# EAGLE design carrier-frontend (EAGLE 5.07)
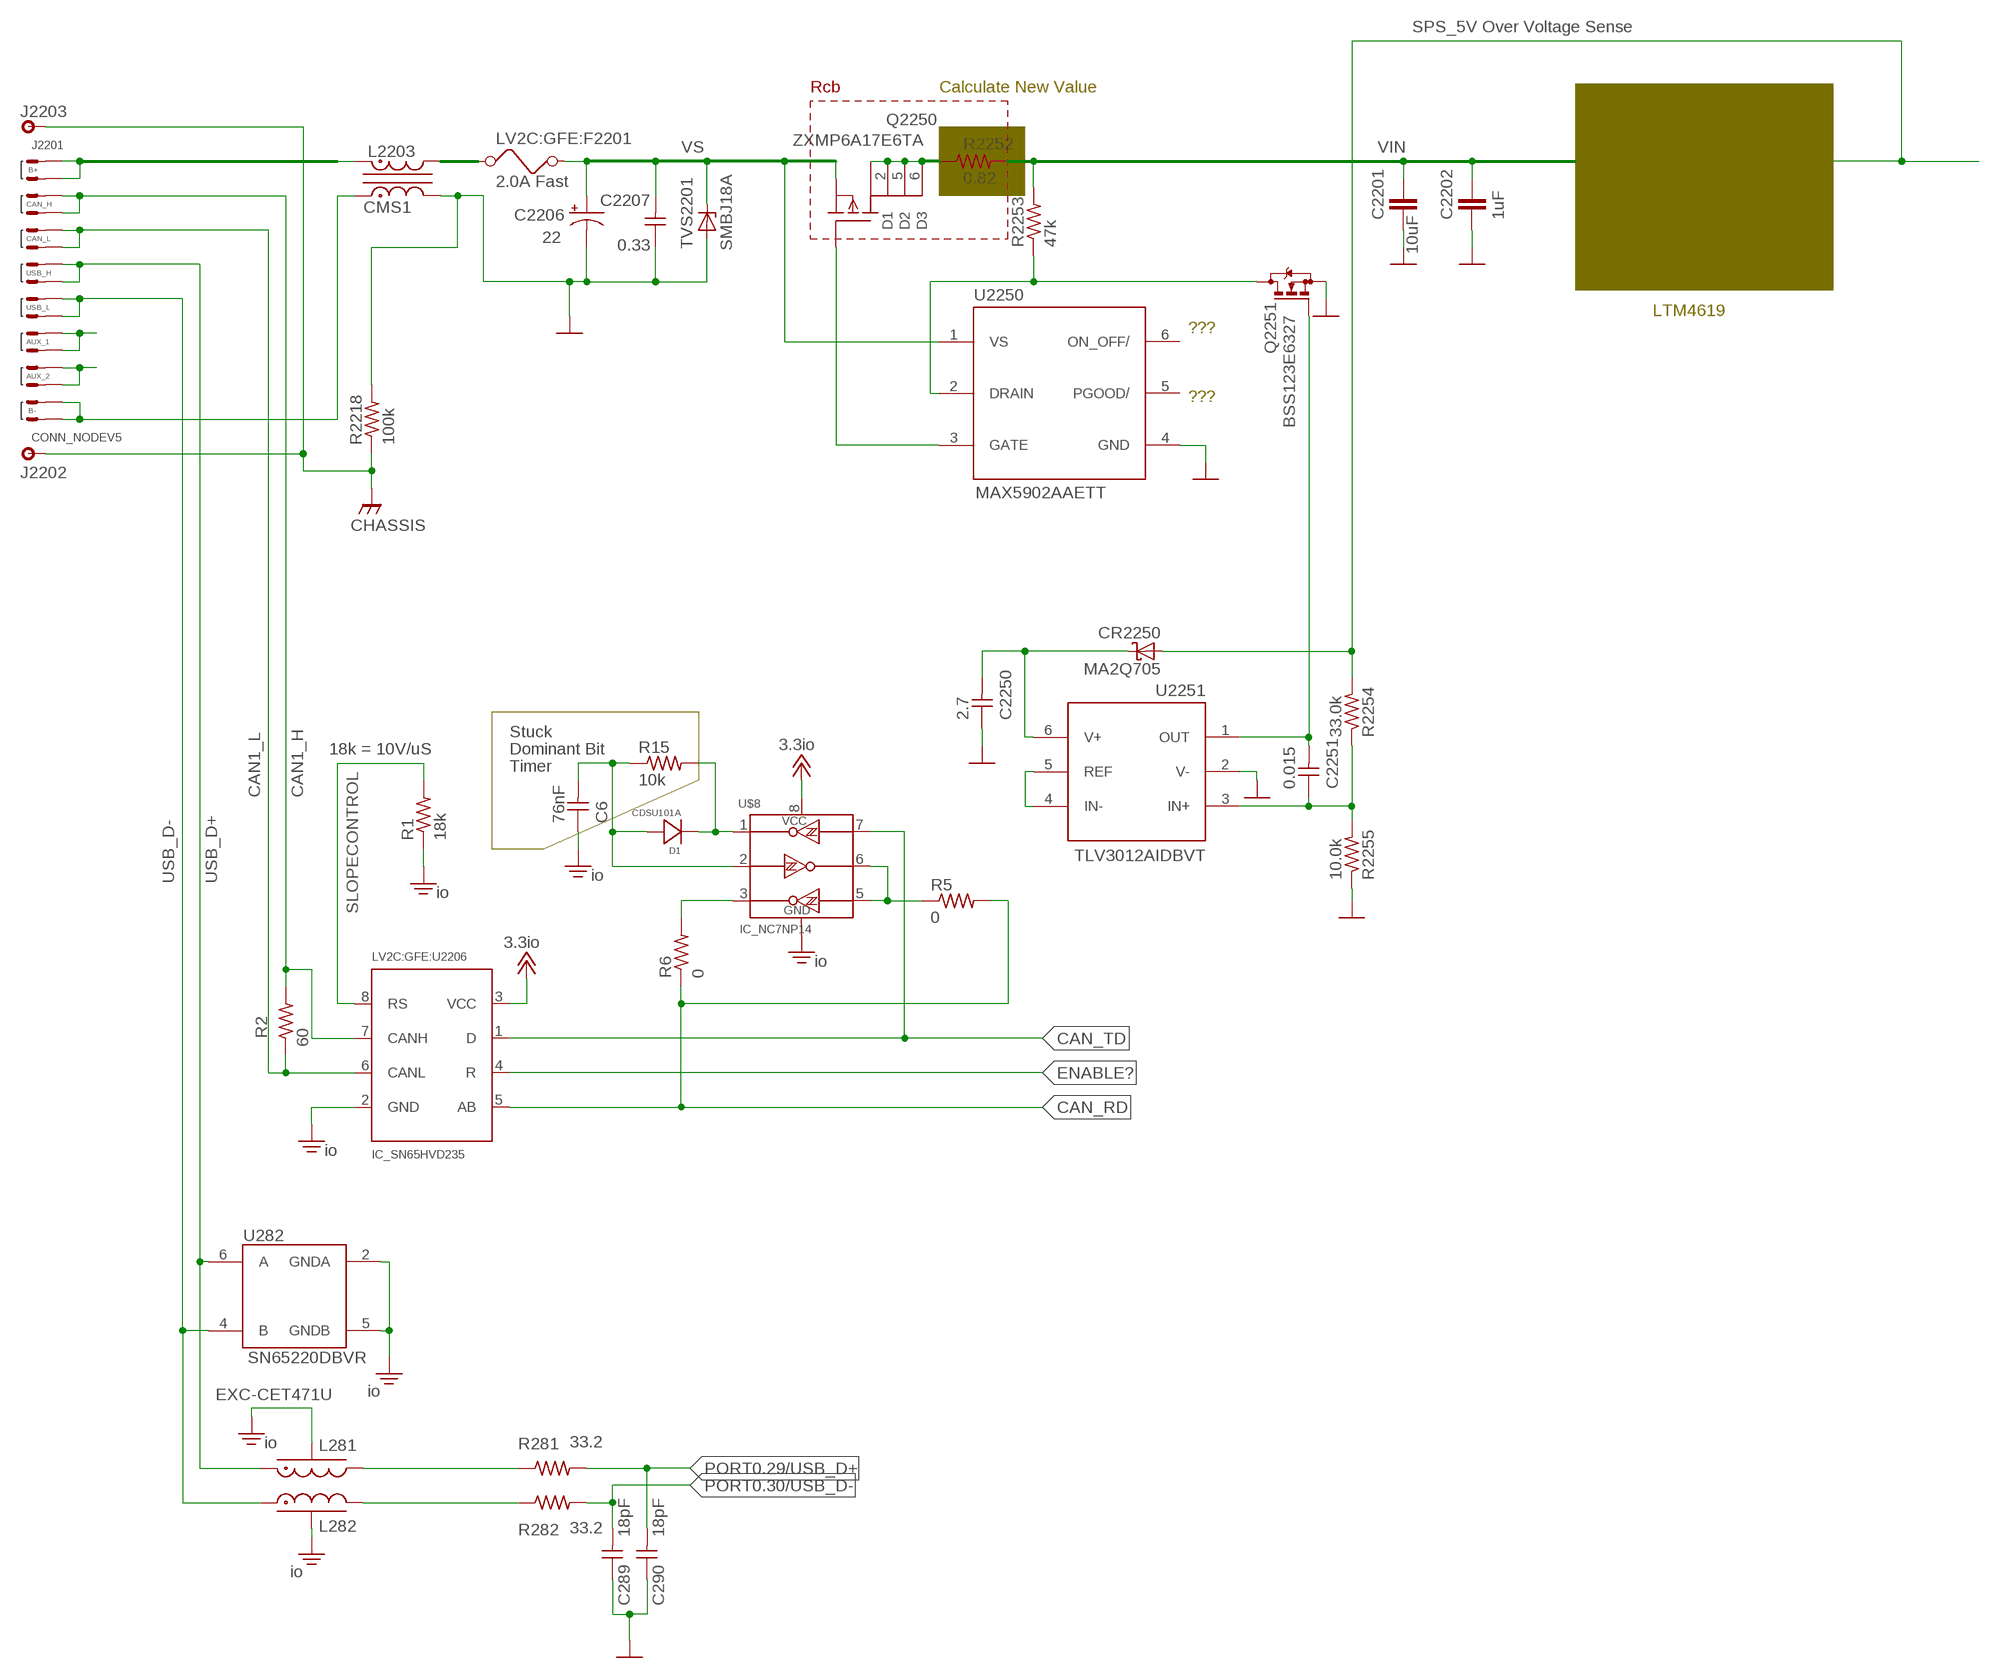
[diagram p0: schematic, sheet 1]

## Parts
C6  76nF  CAP-NP0805  [C0805]
C289  18pF  CAP-NP0603  [C0603]
C290  18pF  CAP-NP0603  [C0603]
C2201  10uF  C-EUC1210  [C1210]
C2202  1uF  C-EUC1206  [C1206]
C2206  22  CPOL-USD/7343-31R  [D/7343-31R]
C2207  0.33  CAP-NP0805  [C0805]
C2250  2.7  CAP-NP0603  [C0603]
C2251  0.015  CAP-NP0603  [C0603]
CR2250  MA2Q705  [NMINIP2-J1]
D1  CDSU101A  DIODE_SILICON-0603  [0603-DIODE]
J2201  CONN_NODEV5  [CONN_16PIN_NODEV5]
J2202  PAD_ROUND028  [PAD_ROUND_APC-FREE_0.1/028]
J2203  PAD_ROUND028  [PAD_ROUND_APC-FREE_0.1/028]
L281  EXC-CET471U  FILTER_EMI-EXC-CET  [EXC-CET]
L282  FILTER_EMI-EXC-CET  [EXC-CET]
L2203  CMS1  COIL_CMS1  [CMS1]
LV2C:GFE:F2201  2.0A Fast  FUSE1206  [1206]
LV2C:GFE:U2206  IC_SN65HVD235  [DR-PDSO-G8]
Q2250  ZXMP6A17E6TA  FET_ZXMP6A17E6  [SOT23-6]
Q2251  BSS123E6327  IC_BSS123  [SOT23-3]
R1  18k  R-US_R0603  [R0603]
R2  60  R-US_R0603  [R0603]
R5  0  R-US_R0603  [R0603]
R6  0  R-US_R0603  [R0603]
R15  10k  R-US_R0603  [R0603]
R281  33.2  R-US_R0603  [R0603]
R282  33.2  R-US_R0603  [R0603]
R2218  100k  R-US_R0805  [R0805]
R2252  0.82  R-US_R0805  [R0805]
R2253  47k  R-US_R0603  [R0603]
R2254  33.0k  R-US_R0603  [R0603]
R2255  10.0k  R-US_R0603  [R0603]
TVS2201  SMBJ18A  ZENER-DIODESMB  [SMB]
U282  SN65220DBVR  IC_SN65220  [SOT23-6]
U2250  MAX5902AAETT  IC_MAX5902  [SOT23-6]
U2251  TLV3012AIDBVT  IC_TLV3012  [SOT23-6]
U$8  IC_NC7NP14  [MICROPAK-8]

## Nets
AUX_1.2: J2201.BOARD+@1(BOARD+1) J2201.BOARD+@2(BOARD+2)
AUX_2.2: J2201.BOARD-@1(BOARD-1) J2201.BOARD-@2(BOARD-2)
BIN: L2203.3 LV2C:GFE:F2201.1
CAN1_H: J2201.CAN+@1(CAN_H1) J2201.CAN+@2(CAN_H2) LV2C:GFE:U2206.7(CANH) R2.2
CAN1_L: J2201.CAN-@1(CAN_L1) J2201.CAN-@2(CAN_L2) LV2C:GFE:U2206.6(CANL) R2.1
CAN_RD: LV2C:GFE:U2206.5(AB) R5.2 R6.1
CAN_TD: LV2C:GFE:U2206.1(D) U$8.7(1A)
CHASSIS: J2202.PAD J2203.PAD R2218.1
DOMINANT_BIT_STUCK_WHEN_HIGH: C6.2 D1.A(ANODE) R15.1 U$8.2(3A)
ENABLE?: LV2C:GFE:U2206.4(R)
GND: C289.1 C290.1 C2201.2 C2202.2 C2206.- C2207.1 C2250.1 L2203.2 Q2251.2(S) R2218.2 R2255.1 TVS2201.A U2250.4(GND) U2251.2(V-)
IN+: C2251.1 R2254.1 R2255.2 U2251.3(IN+)
INV-INV: R5.1 U$8.5(2A) U$8.6(3Y)
INV_DATA: D1.K(CATHODE) R15.2 U$8.1(1Y)
IO_3P3: U$8.8(VCC) ; supply symbol labelled 3.3io
IO_GND: L281.C(COMMON) L282.C(COMMON) LV2C:GFE:U2206.2(GND) U282.2(GNDA) U282.5(GNDB) U$8.4(GND) ; supply symbol labelled io
N$2: J2201.B+@1(B+1) J2201.B+@2(B+2) L2203.4
N$6: R6.2 U$8.3(2Y)
N_DRAIN: Q2251.3(D) R2253.1 U2250.2(DRAIN)
N_GATE: C2251.2 Q2251.1(G) U2251.1(OUT)
P_GATE: Q2250.3(G) U2250.3(GATE)
PORT0.29/USB_D+: C290.2 R281.2
PORT0.30/USB_D-: C289.2 R282.2
REF: U2251.4(IN-) U2251.5(REF)
SH_GND: J2201.B-@1(B-1) J2201.B-@2(B-2) L2203.1
SLOPECONTROL: LV2C:GFE:U2206.8(RS) R1.2
SPS-5V: CR2250.A R2254.2
TRIPLE_BAR_GND: C6.1 R1.1 ; supply symbol labelled io
USB_D+: J2201.USB+@1(USB+1) J2201.USB+@2(USB+2) L281.1 U282.6(A)
USB_D-: J2201.USB-@1(USB-1) J2201.USB-@2(USB-2) L282.1 U282.4(B)
USBD+: L281.2 R281.1
USBD-: L282.2 R282.1
V+: C2250.2 CR2250.C U2251.6(V+)
VIN: C2201.1 C2202.1 R2252.2 R2253.2
VS: C2206.+ C2207.2 LV2C:GFE:F2201.2 Q2250.4(S) TVS2201.C U2250.1(VS)
VS_SENSE: Q2250.1(D) Q2250.2(D1) Q2250.5(D2) Q2250.6(D3) R2252.1
Unconnected: LV2C:GFE:U2206.3(VCC) U2250.5(PGOOD/) U2250.6(ON_OFF/)

## Notes on the sheet
- SPS_5V Over Voltage Sense
- Rcb | Calculate New Value
- LTM4619
- ???
- ???
- Stuck
- 18k = 10V/uS | Dominant Bit
- Timer

## Library data of the parts
C6 C289 C290 C2250 C2251 = node4:CAP-NP
C2201 C2202 = rcl:C-EU: CAPACITOR, European symbol
C2206 = rcl:CPOL-US: POLARIZED CAPACITOR, American symbol
C2207 = discrete-smd-ipc:CAP-NP
CR2250 = custom:MA2Q705
D1 = psas_eagle_library:DIODE_SILICON-*: Generic Silicon Diode
J2201 = ScottsLib:CONN_NODEV5: JST-16PS-JED CONNECTOR MODIFIED WITH BOLT HOLES. BOARD+, BOARD- USED IN BOARD-BOARD CONNECTIONS
J2202 J2203 = psas_eagle_library:PAD_ROUND: Round plated through holes of various sizes, mostly from the apc free drill list.
L281 L282 = psas_eagle_library:FILTER_EMI: EMI fliter combines RF chokes and capacitor in pi-arrangement
L2203 = psas_eagle_library:COIL_CMS1: Coiltronics CMS1 series common mode choke
LV2C:GFE:F2201 = custom:FUSE: Fuse
LV2C:GFE:U2206 = 0kaz:IC_SN65HVD235: +3.3V CAN Transceiver with Autobaud (listen only) from TI
Q2250 = node4:FET_ZXMP6A17E6: ZXMP6A17E6 P-channel enhancement mode MOSFET
Q2251 = node4:IC_BSS123: BSS123 N-Channel Enhancement Mode Logic Level MOSFET
R1 R2 R5 R6 R15 R281 R282 R2218 R2252-R2255 = rcl:R-US_: RESISTOR, American symbol
TVS2201 = diode:ZENER-DIODE: Z-Diode
U282 = node4:IC_SN65220: SN65220 USB port transient suppressor
U2250 = node4:IC_MAX5902: MAX5902 Hot swap controller
U2251 = node4:IC_TLV3012: TLV3012 Nano power comparator with voltage reference
U$8 = 0kaz:IC_NC7NP14: Triple Inverter with Schmitt Trigger Input FairchildSemi http://www.fairchildsemi.com/ds/NC%2FNC7NP14.pdf

## Board
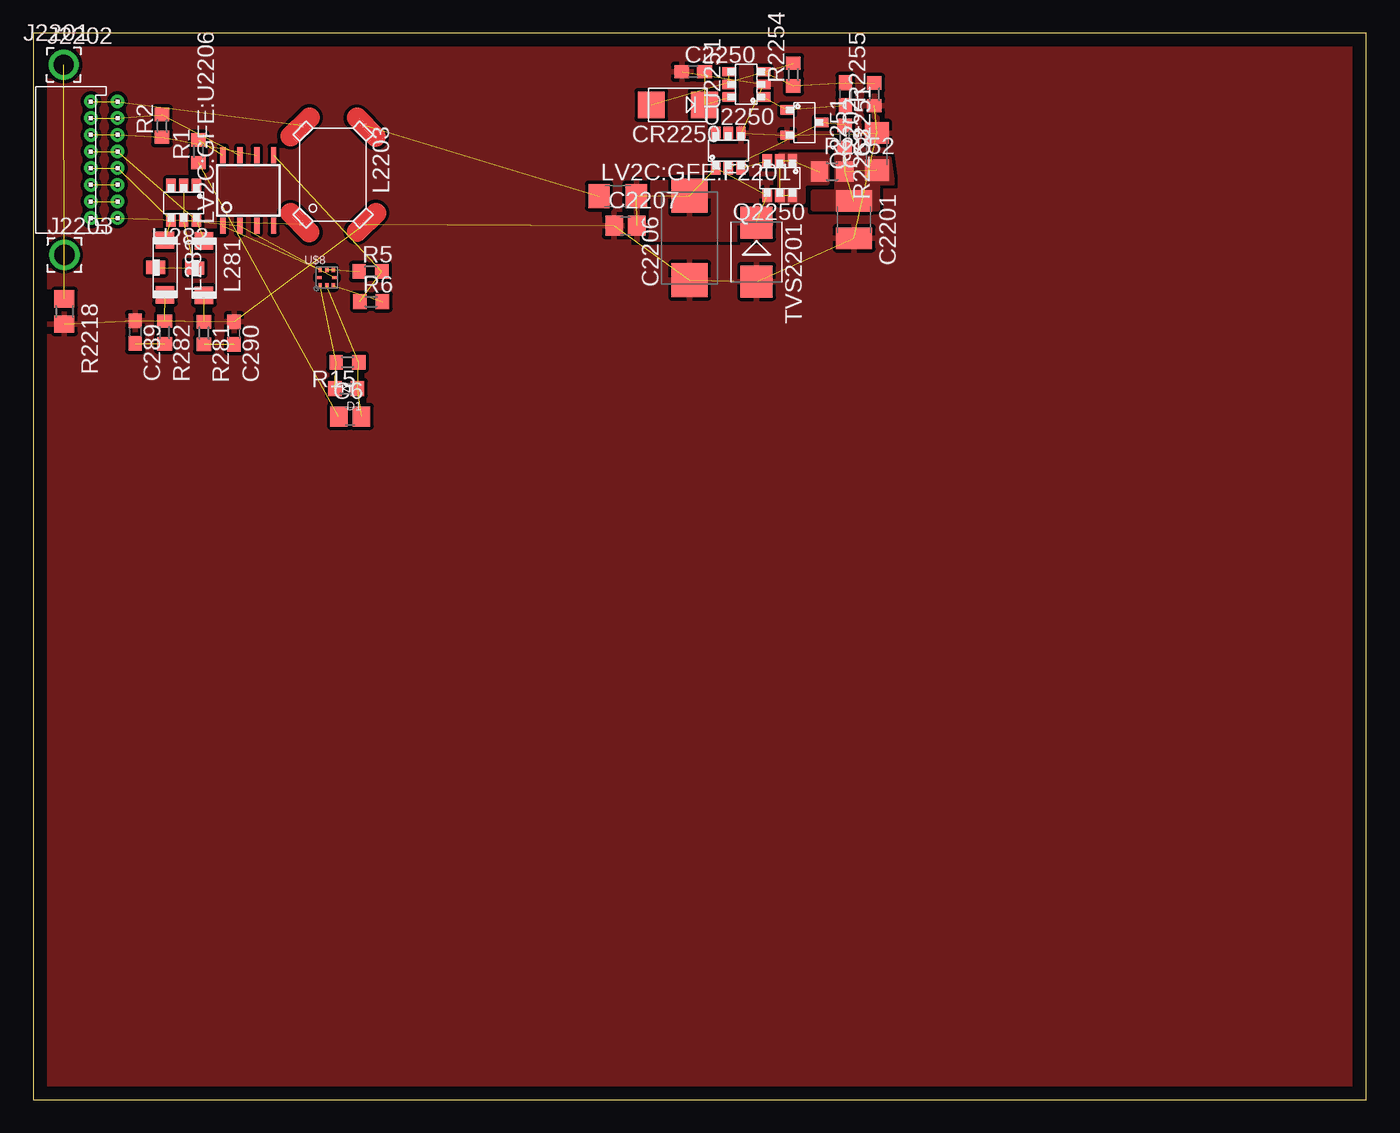
[diagram p1: board, top side]
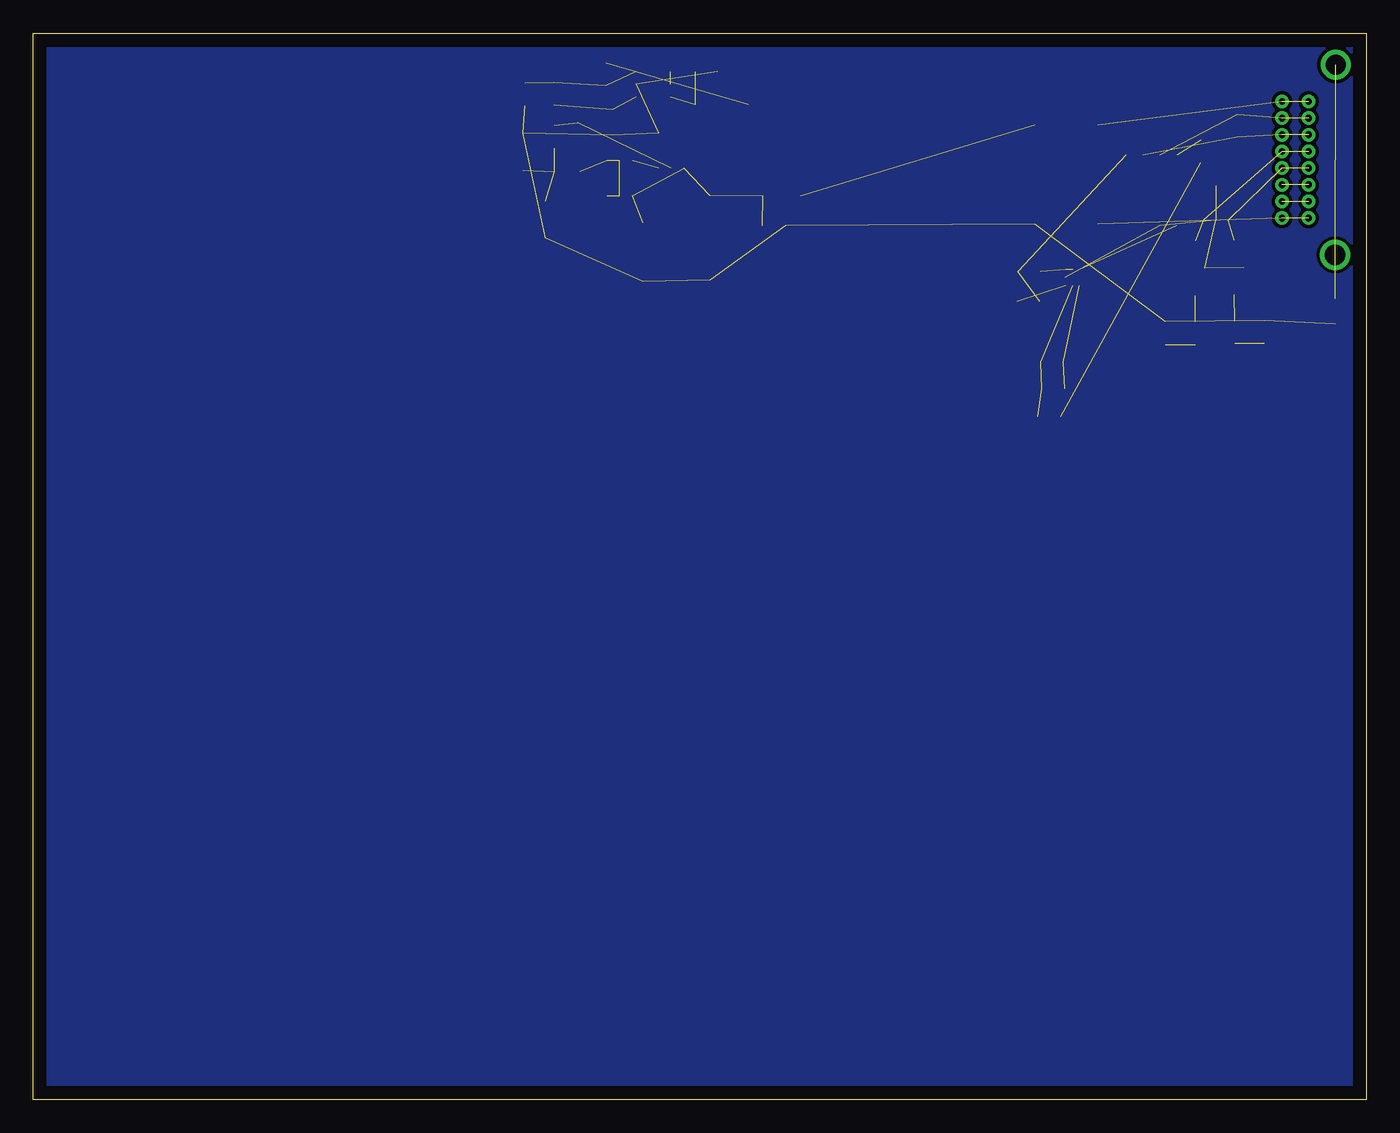
[diagram p2: board, bottom side, seen from below]

Size 100 x 80 mm. Coordinates in mm from the lower left corner, seen from the top.
Outline: 0,0 100,0 100,80 0,80 0,0
Copper layers (1+2*15+16): Top 0.035mm / dielectric 1.5mm / Route2 0.035mm / dielectric 0.15mm / Route15 0.035mm / dielectric 0.2mm / Bottom 0.035mm
Design rules "default *": minimum track width 8mil, minimum drill 16mil, track to track 8mil, track to pad 8mil, pad to pad 8mil, via to via 8mil, smd to smd 8mil, copper to edge 40mil, drill to drill 8mil, minimum pad ring 10mil, minimum via ring 8mil, stop-mask expansion 4mil, vias tented up to drill 0mil, thermal gap 10mil

### Footprints (pad centres in the part's own frame; a part is rotated, then mirrored left to right if it is on the bottom)
C0805 = smd 1.3 x 1.5: 1 -0.85,0; 2 0.85,0
C0603 = smd 1.1 x 1: 1 -0.85,0; 2 0.85,0
C1210 = smd 1.6 x 2.7: 1 -1.4,0; 2 1.4,0
C1206 = smd 1.6 x 1.8: 1 -1.4,0; 2 1.4,0
D/7343-31R = smd 2.55 x 2.7: + 3.175,0; - -3.175,0
NMINIP2-J1 = smd 2 x 2: A 2,0; C -2,0
0603-DIODE = smd 1 x 1.1: A -0.85,0; K 0.85,0
CONN_16PIN_NODEV5 = drill 0.508 pad 1.016 round: B+@1 0,4.375; B+@2 2,4.375; B-@1 0,-4.375; B-@2 2,-4.375; BOARD+@1 0,-1.875; BOARD+@2 2,-1.875; BOARD-@1 0,-3.125; BOARD-@2 2,-3.125; CAN+@1 0,3.125; CAN+@2 2,3.125; CAN-@1 0,1.875; CAN-@2 2,1.875; USB+@1 0,0.625; USB+@2 2,0.625; USB-@1 0,-0.625; USB-@2 2,-0.625 | drill 1.511 round: CHASSIS@1 -2.032,7.136; CHASSIS@2 -1.982,-7.136
PAD_ROUND_APC-FREE_0.1/028 = drill 0.711 round: PAD 0,0
EXC-CET = smd 1.3 x 1.4: 1 -2.05,0; 2 2.05,0 | smd 1 x 1.4: C 0,-0.7
CMS1 = smd 0.254 x 0.254: 1 3.708,-2.362; 2 3.708,2.362; 3 -3.708,2.362; 4 -3.708,-2.362
1206 = smd 1.6 x 1.8: 1 -1.4,0; 2 1.4,0
DR-PDSO-G8 = smd 0.4 x 1.2: 1 -1.905,-2.65; 2 -0.635,-2.65; 3 0.635,-2.65; 4 1.905,-2.65; 5 1.905,2.65; 6 0.635,2.65; 7 -0.635,2.65; 8 -1.905,2.65
SOT23-6 = smd 0.7 x 1: 1 -0.95,-1.3; 2 0,-1.3; 3 0.95,-1.3; 4 0.95,1.3; 5 0,1.3; 6 -0.95,1.3
SOT23-3 = smd 0.7 x 1: 1 -0.95,-1.3; 2 0.95,-1.3; 3 0,1.3
R0603 = smd 1 x 1.1: 1 -0.85,0; 2 0.85,0
R0805 = smd 1.3 x 1.5: 1 -0.95,0; 2 0.95,0
SMB = smd 2.4 x 2.4: A 2.2,0; C -2.2,0
MICROPAK-8 = smd 0.25 x 0.4: 1 -0.5,-0.61; 2 0,-0.61; 3 0.5,-0.61; 5 0.5,0.61; 6 0,0.61; 7 -0.5,0.61 | smd 0.4 x 0.25: 4 0.6,0; 8 -0.6,0

### Placement (x,y rotation side)
C6  23.77,51.26 0 top
C289  7.65,57.58 270 top
C290  15.06,57.51 270 top
C2201  61.57,66.02 270 top
C2202  63.27,71.12 90 top
C2206  49.24,64.64 90 top
C2207  44.43,65.56 0 top
C2250  49.5,77.11 0 top
C2251  60.93,75.44 270 top
CR2250  48.36,74.63 180 top
D1  23.47,53.34 180 top
J2201  4.32,70.51 0 top
J2202  2.29,77.65 0 top
J2203  2.34,63.37 0 top
L281  12.8,62.38 270 top
L282  9.88,62.43 270 top
L2203  22.48,69.39 270 top
LV2C:GFE:F2201  43.84,67.79 0 top
LV2C:GFE:U2206  16.13,68.22 0 top
Q2250  56.01,69.14 180 top
Q2251  57.86,73.3 270 top
R1  12.4,71.15 90 top
R2  9.65,73.05 90 top
R5  25.3,62.13 0 top
R6  25.35,59.87 0 top
R15  23.57,55.32 180 top
R281  12.8,57.51 270 top
R282  9.86,57.56 270 top
R2218  2.34,59.13 270 top
R2252  59.93,69.63 0 top
R2253  60.88,72.25 270 top
R2254  57.02,76.91 90 top
R2255  63.09,75.41 90 top
TVS2201  54.26,63.58 270 top
U282  11.28,67.28 180 top
U2250  52.15,71.2 0 top
U2251  53.49,76.17 90 top
U$8  22.02,61.67 0 top

### Tracks (layer width: path | path; a pad name or v marks a point on that pad's centre or on a via)
AUX_1.2  (1 unrouted)
AUX_2.2  (1 unrouted)
BIN  (1 unrouted)
CAN1_H  (3 unrouted)
CAN1_L  (3 unrouted)
CAN_RD  (2 unrouted)
CAN_TD  (1 unrouted)
CHASSIS  (2 unrouted)
DOMINANT_BIT_STUCK_WHEN_HIGH  (3 unrouted)
GND  (13 unrouted)
  pour Top (isolate 0.254, rank 4): 0.43,79.78 99.64,79.63 99.75,0.43 0.43,0.43 0.25,79.81
  pour Bottom (isolate 0.254, no thermals): 0.89,79.22 0.89,79.35 99.54,79.35 99.54,0.97 0.48,0.97 0.48,79.45 0.64,79.45
IN+  (3 unrouted)
INV-INV  (2 unrouted)
INV_DATA  (2 unrouted)
IO_GND  (5 unrouted)
N$2  (2 unrouted)
N$6  (1 unrouted)
N_DRAIN  (2 unrouted)
N_GATE  (2 unrouted)
P_GATE  (1 unrouted)
PORT0.29/USB_D+  (1 unrouted)
PORT0.30/USB_D-  (1 unrouted)
REF  (1 unrouted)
SH_GND  (2 unrouted)
SLOPECONTROL  (1 unrouted)
SPS-5V  (1 unrouted)
TRIPLE_BAR_GND  (1 unrouted)
USB_D+  (3 unrouted)
USB_D-  (3 unrouted)
USBD+  (1 unrouted)
USBD-  (1 unrouted)
V+  (2 unrouted)
VIN  (3 unrouted)
  pour Top (isolate 0.254, no thermals): 58.52,68.1 60.3,68.1 60.3,71.78 61.19,71.78 61.19,70.69 64.19,70.59 64.44,68.76 63.35,68.81 63.35,66.83 58.52,66.83
VS  (5 unrouted)
  pour Top (isolate 0.254): 44.83,68.81 55.3,68.86 55.3,64.57 46.74,64.57 44.81,64.54 44.81,66.73
VS_SENSE  (4 unrouted)
  pour Top (isolate 0.254, no thermals): 56.01,70.84 59.54,70.87 59.54,68.78 57.89,68.76 57.86,68.68 57.76,68.68 57.76,67.39 56.01,67.39